# EAGLE design osh-2l-cpwg (EAGLE 9.4.1)
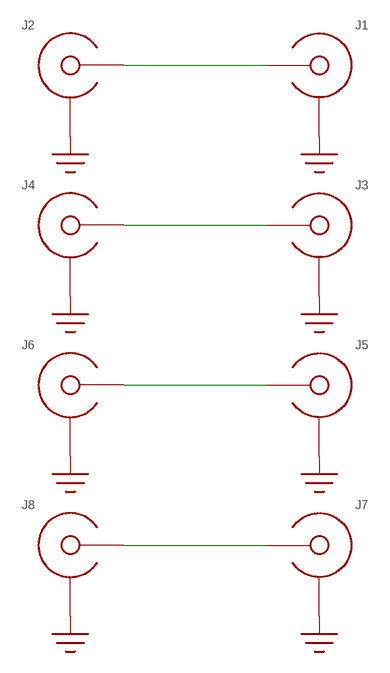
[diagram p0: schematic, sheet 1]

## Parts
J1  SMA-EDGE-LAUNCH4020_TAPER  [SMA_EDGE_LAUNCH_2L_4020_TAPER]
J2  SMA-EDGE-LAUNCHCUT-PIN  [SMA_EDGE_LAUNCH_2L_4020_CUT_PIN]
J3  SMA-EDGE-LAUNCH4020_TAPER  [SMA_EDGE_LAUNCH_2L_4020_TAPER]
J4  SMA-EDGE-LAUNCHCUT-PIN  [SMA_EDGE_LAUNCH_2L_4020_CUT_PIN]
J5  SMA-EDGE-LAUNCH4020_TAPER  [SMA_EDGE_LAUNCH_2L_4020_TAPER]
J6  SMA-EDGE-LAUNCHCUT-PIN  [SMA_EDGE_LAUNCH_2L_4020_CUT_PIN]
J7  SMA-EDGE-LAUNCH4020_TAPER  [SMA_EDGE_LAUNCH_2L_4020_TAPER]
J8  SMA-EDGE-LAUNCHCUT-PIN  [SMA_EDGE_LAUNCH_2L_4020_CUT_PIN]

## Nets
GND: J1.BOTTOM_GND(SHIELD) J1.GND@1(SHIELD) J1.GND@2(SHIELD) J1.GND@3(SHIELD) J1.GND@4(SHIELD) J1.GND@5(SHIELD) J1.GND@6(SHIELD) J1.GND@7(SHIELD) J1.GND@8(SHIELD) J1.GND@14(SHIELD) J1.GND@15(SHIELD) J1.GND@16(SHIELD) J1.GND@17(SHIELD) J1.GND_PAD1(SHIELD) J1.GND_PAD2(SHIELD) J1.P$1(SHIELD) J1.P$2(SHIELD) J2.BOTTOM_GND(SHIELD) J2.GND@1(SHIELD) J2.GND@2(SHIELD) J2.GND@3(SHIELD) J2.GND@4(SHIELD) J2.GND@5(SHIELD) J2.GND@6(SHIELD) J2.GND@7(SHIELD) J2.GND@8(SHIELD) J2.GND@14(SHIELD) J2.GND@15(SHIELD) J2.GND@16(SHIELD) J2.GND@17(SHIELD) J2.GND_PAD1(SHIELD) J2.GND_PAD2(SHIELD) J3.BOTTOM_GND(SHIELD) J3.GND@1(SHIELD) J3.GND@2(SHIELD) J3.GND@3(SHIELD) J3.GND@4(SHIELD) J3.GND@5(SHIELD) J3.GND@6(SHIELD) J3.GND@7(SHIELD) J3.GND@8(SHIELD) J3.GND@14(SHIELD) J3.GND@15(SHIELD) J3.GND@16(SHIELD) J3.GND@17(SHIELD) J3.GND_PAD1(SHIELD) J3.GND_PAD2(SHIELD) J3.P$1(SHIELD) J3.P$2(SHIELD) J4.BOTTOM_GND(SHIELD) J4.GND@1(SHIELD) J4.GND@2(SHIELD) J4.GND@3(SHIELD) J4.GND@4(SHIELD) J4.GND@5(SHIELD) J4.GND@6(SHIELD) J4.GND@7(SHIELD) J4.GND@8(SHIELD) J4.GND@14(SHIELD) J4.GND@15(SHIELD) J4.GND@16(SHIELD) J4.GND@17(SHIELD) J4.GND_PAD1(SHIELD) J4.GND_PAD2(SHIELD) J5.BOTTOM_GND(SHIELD) J5.GND@1(SHIELD) J5.GND@2(SHIELD) J5.GND@3(SHIELD) J5.GND@4(SHIELD) J5.GND@5(SHIELD) J5.GND@6(SHIELD) J5.GND@7(SHIELD) J5.GND@8(SHIELD) J5.GND@14(SHIELD) J5.GND@15(SHIELD) J5.GND@16(SHIELD) J5.GND@17(SHIELD) J5.GND_PAD1(SHIELD) J5.GND_PAD2(SHIELD) J5.P$1(SHIELD) J5.P$2(SHIELD) J6.BOTTOM_GND(SHIELD) J6.GND@1(SHIELD) J6.GND@2(SHIELD) J6.GND@3(SHIELD) J6.GND@4(SHIELD) J6.GND@5(SHIELD) J6.GND@6(SHIELD) J6.GND@7(SHIELD) J6.GND@8(SHIELD) J6.GND@14(SHIELD) J6.GND@15(SHIELD) J6.GND@16(SHIELD) J6.GND@17(SHIELD) J6.GND_PAD1(SHIELD) J6.GND_PAD2(SHIELD) J7.BOTTOM_GND(SHIELD) J7.GND@1(SHIELD) J7.GND@2(SHIELD) J7.GND@3(SHIELD) J7.GND@4(SHIELD) J7.GND@5(SHIELD) J7.GND@6(SHIELD) J7.GND@7(SHIELD) J7.GND@8(SHIELD) J7.GND@14(SHIELD) J7.GND@15(SHIELD) J7.GND@16(SHIELD) J7.GND@17(SHIELD) J7.GND_PAD1(SHIELD) J7.GND_PAD2(SHIELD) J7.P$1(SHIELD) J7.P$2(SHIELD) J8.BOTTOM_GND(SHIELD) J8.GND@1(SHIELD) J8.GND@2(SHIELD) J8.GND@3(SHIELD) J8.GND@4(SHIELD) J8.GND@5(SHIELD) J8.GND@6(SHIELD) J8.GND@7(SHIELD) J8.GND@8(SHIELD) J8.GND@14(SHIELD) J8.GND@15(SHIELD) J8.GND@16(SHIELD) J8.GND@17(SHIELD) J8.GND_PAD1(SHIELD) J8.GND_PAD2(SHIELD)
N$1 [30-6]: J1.CENTER@1(CENTER) J2.CENTER@1(CENTER) J2.CENTER@3(CENTER)
N$2 [29-6]: J3.CENTER@1(CENTER) J4.CENTER@1(CENTER) J4.CENTER@3(CENTER)
N$3 [28-6]: J5.CENTER@1(CENTER) J6.CENTER@1(CENTER) J6.CENTER@3(CENTER)
N$4 [27-6]: J7.CENTER@1(CENTER) J8.CENTER@1(CENTER) J8.CENTER@3(CENTER)

## Library data of the parts
J1-J8 = sma_footprint_2l:SMA-EDGE-LAUNCH

## Net classes
1 26-6: width 0.66 mm, clearance 0.152 mm
2 27-6: width 0.686 mm, clearance 0.152 mm
3 28-6: width 0.711 mm, clearance 0.152 mm
4 29-6: width 0.737 mm, clearance 0.152 mm
5 30-6: width 0.762 mm, clearance 0.152 mm

## Board
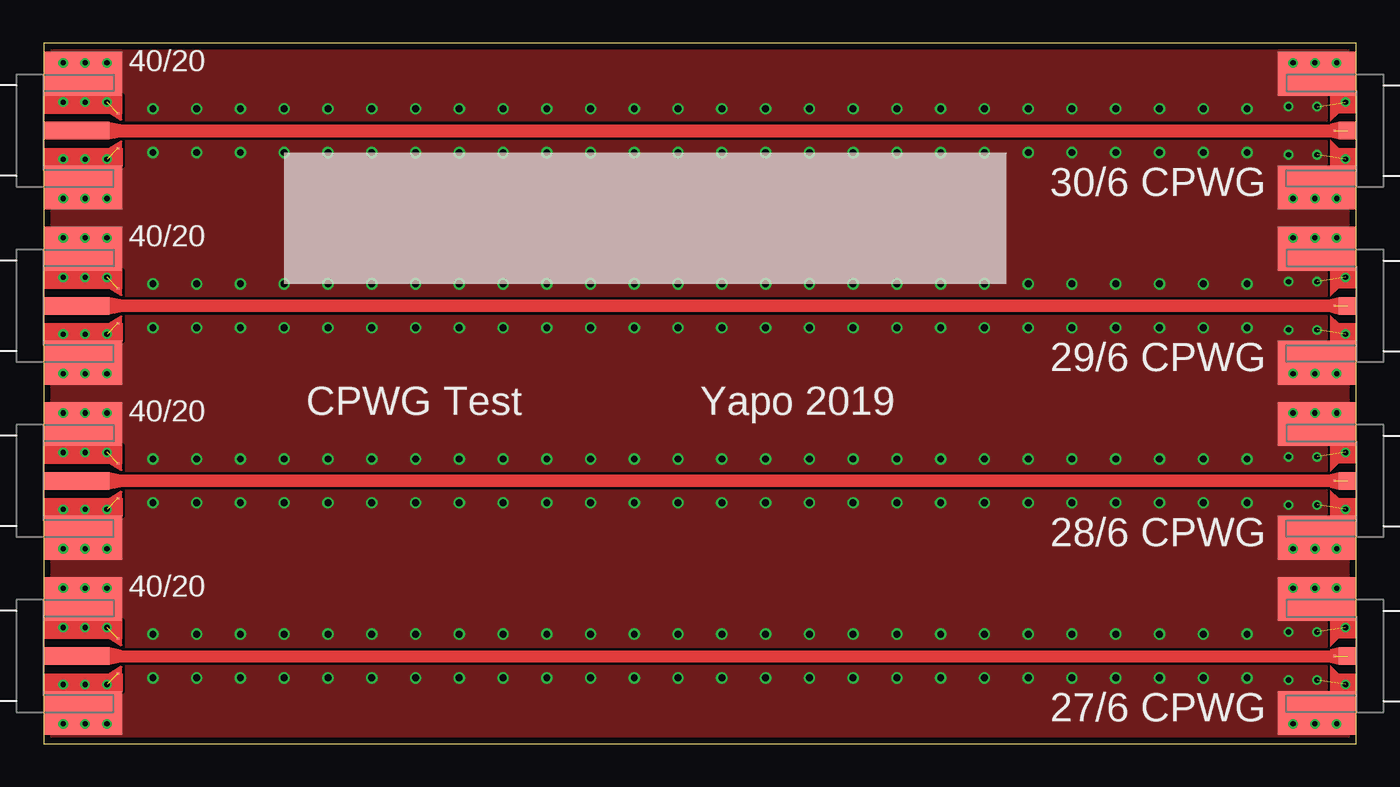
[diagram p1: board, top side]
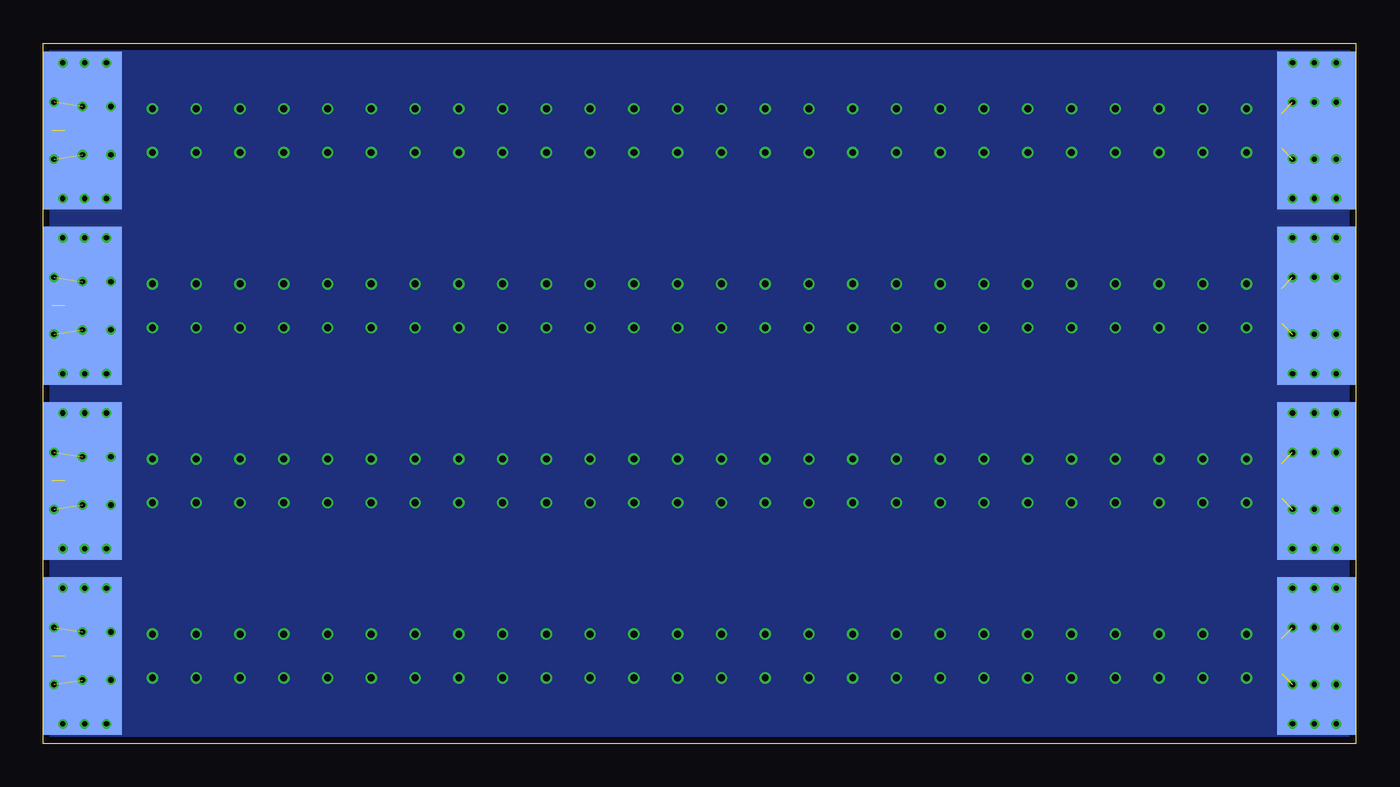
[diagram p2: board, bottom side, seen from below]

Size 76.2 x 40.64 mm. Coordinates in mm from the lower left corner, seen from the top.
Outline: 0,0 76.2,0 76.2,40.64 0,40.64 0,0
Copper layers (1*16): Top 0.035559375mm / dielectric 1.6mm / Bottom 0.035559375mm
Design rules "oshpark-2layer *": minimum track width 6mil, minimum drill 10mil, track to track 6mil, track to pad 6mil, pad to pad 6mil, via to via 6mil, smd to smd 6mil, copper to edge 15mil, drill to drill 6mil, minimum pad ring 5mil, minimum via ring 5mil, stop-mask expansion 2.5mil, vias tented up to drill 20mil, thermal gap 10mil

### Footprints (pad centres in the part's own frame; a part is rotated, then mirrored left to right if it is on the bottom)
SMA_EDGE_LAUNCH_2L_4020_TAPER = smd 4.572 x 9.144 bottom: BOTTOM_GND 2.286,0 | smd 3.81 x 1.016: CENTER@1 1.905,0 | drill 0.3: GND@1 1.143,3.937; GND@2 3.683,3.937; GND@3 1.143,1.651; GND@4 3.683,1.651; GND@5 1.143,-1.651; GND@6 3.683,-1.651; GND@7 1.143,-3.937; GND@8 3.683,-3.937; GND@14 2.413,3.937; GND@15 2.413,-3.937; GND@16 2.413,-1.651; GND@17 2.413,1.651 | smd 4.572 x 2.54: GND_PAD1 2.286,3.302; GND_PAD2 2.286,-3.302 | smd 0.127 x 0.127: P$1 4.318,1.016; P$2 4.318,-1.016
SMA_EDGE_LAUNCH_2L_4020_CUT_PIN = smd 4.572 x 9.144 bottom: BOTTOM_GND 2.286,0 | smd 1.016 x 1.016: CENTER@1 0.508,0 | smd 0.127 x 0.127: CENTER@3 1.27,0 | drill 0.3: GND@1 1.143,3.937; GND@2 3.683,3.937; GND@3 0.635,1.651; GND@4 3.937,1.397; GND@5 3.937,-1.397; GND@6 0.635,-1.651; GND@7 1.143,-3.937; GND@8 3.683,-3.937; GND@14 2.413,3.937; GND@15 2.413,-3.937; GND@16 2.286,-1.397; GND@17 2.286,1.397 | smd 4.572 x 2.54: GND_PAD1 2.286,3.302; GND_PAD2 2.286,-3.302

### Placement (x,y rotation side)
J1  0,35.56 0 top
J2  76.2,35.56 180 top
J3  0,25.4 0 top
J4  76.2,25.4 180 top
J5  0,15.24 0 top
J6  76.2,15.24 180 top
J7  0,5.08 0 top
J8  76.2,5.08 180 top

### Tracks (layer width: path | path; a pad name or v marks a point on that pad's centre or on a via)
GND  (via drill 0.4)  (16 unrouted)
  other vias: 6.35,36.83 8.89,36.83 11.43,36.83 13.97,36.83 16.51,36.83 19.05,36.83 21.59,36.83 24.13,36.83 26.67,36.83 29.21,36.83 31.75,36.83 34.29,36.83 36.83,36.83 39.37,36.83 41.91,36.83 44.45,36.83 46.99,36.83 49.53,36.83 52.07,36.83 54.61,36.83 57.15,36.83 59.69,36.83 62.23,36.83 64.77,36.83 67.31,36.83 69.85,36.83 6.35,34.29 8.89,34.29 11.43,34.29 13.97,34.29 16.51,34.29 19.05,34.29 21.59,34.29 24.13,34.29 26.67,34.29 29.21,34.29 31.75,34.29 34.29,34.29 36.83,34.29 39.37,34.29 41.91,34.29 44.45,34.29 46.99,34.29 49.53,34.29 52.07,34.29 54.61,34.29 57.15,34.29 59.69,34.29 62.23,34.29 64.77,34.29 67.31,34.29 69.85,34.29 6.35,26.67 8.89,26.67 11.43,26.67 13.97,26.67 16.51,26.67 19.05,26.67 21.59,26.67 24.13,26.67 26.67,26.67 29.21,26.67 31.75,26.67 34.29,26.67 36.83,26.67 39.37,26.67 41.91,26.67 44.45,26.67 46.99,26.67 49.53,26.67 52.07,26.67 54.61,26.67 57.15,26.67 59.69,26.67 62.23,26.67 64.77,26.67 67.31,26.67 69.85,26.67 6.35,24.13 8.89,24.13 11.43,24.13 13.97,24.13 16.51,24.13 19.05,24.13 21.59,24.13 24.13,24.13 26.67,24.13 29.21,24.13 31.75,24.13 34.29,24.13 36.83,24.13 39.37,24.13 41.91,24.13 44.45,24.13 46.99,24.13 49.53,24.13 52.07,24.13 54.61,24.13 57.15,24.13 59.69,24.13 62.23,24.13 64.77,24.13 67.31,24.13 69.85,24.13 6.35,16.51 8.89,16.51 11.43,16.51 13.97,16.51 16.51,16.51 19.05,16.51 21.59,16.51 24.13,16.51 26.67,16.51 29.21,16.51 31.75,16.51 34.29,16.51 36.83,16.51 39.37,16.51 41.91,16.51 44.45,16.51 46.99,16.51 49.53,16.51 52.07,16.51 54.61,16.51 57.15,16.51 59.69,16.51 62.23,16.51 64.77,16.51 67.31,16.51 69.85,16.51 6.35,13.97 8.89,13.97 11.43,13.97 13.97,13.97 16.51,13.97 19.05,13.97 21.59,13.97 24.13,13.97 26.67,13.97 29.21,13.97 31.75,13.97 34.29,13.97 36.83,13.97 39.37,13.97 41.91,13.97 44.45,13.97 46.99,13.97 49.53,13.97 52.07,13.97 54.61,13.97 57.15,13.97 59.69,13.97 62.23,13.97 64.77,13.97 67.31,13.97 69.85,13.97 6.35,6.35 8.89,6.35 11.43,6.35 13.97,6.35 16.51,6.35 19.05,6.35 21.59,6.35 24.13,6.35 26.67,6.35 29.21,6.35 31.75,6.35 34.29,6.35 36.83,6.35 39.37,6.35 41.91,6.35 44.45,6.35 46.99,6.35 49.53,6.35 52.07,6.35 54.61,6.35 57.15,6.35 59.69,6.35 62.23,6.35 64.77,6.35 67.31,6.35 69.85,6.35 6.35,3.81 8.89,3.81 11.43,3.81 13.97,3.81 16.51,3.81 19.05,3.81 21.59,3.81 24.13,3.81 26.67,3.81 29.21,3.81 31.75,3.81 34.29,3.81 36.83,3.81 39.37,3.81 41.91,3.81 44.45,3.81 46.99,3.81 49.53,3.81 52.07,3.81 54.61,3.81 57.15,3.81 59.69,3.81 62.23,3.81 64.77,3.81 67.31,3.81 69.85,3.81
  pour Top (no thermals): 0,0 0,40.64 76.2,40.64 76.2,0
  pour Bottom: 0,0 0,40.64 76.2,40.64 76.2,0
N$1  (1 unrouted)
  Top 0.762: J1.CENTER@1 J2.CENTER@3
N$2  (1 unrouted)
  Top 0.737: J3.CENTER@1 J4.CENTER@3
N$3  (1 unrouted)
  Top 0.711: J5.CENTER@1 J6.CENTER@3
N$4  (1 unrouted)
  Top 0.686: J7.CENTER@1 J8.CENTER@3

### Text on the board
tPlace: 30/6 CPWG | 29/6 CPWG | CPWG Test | Yapo 2019 | 28/6 CPWG | 27/6 CPWG